# Altium schematic sheet 05pwr_input.SchDoc
size B
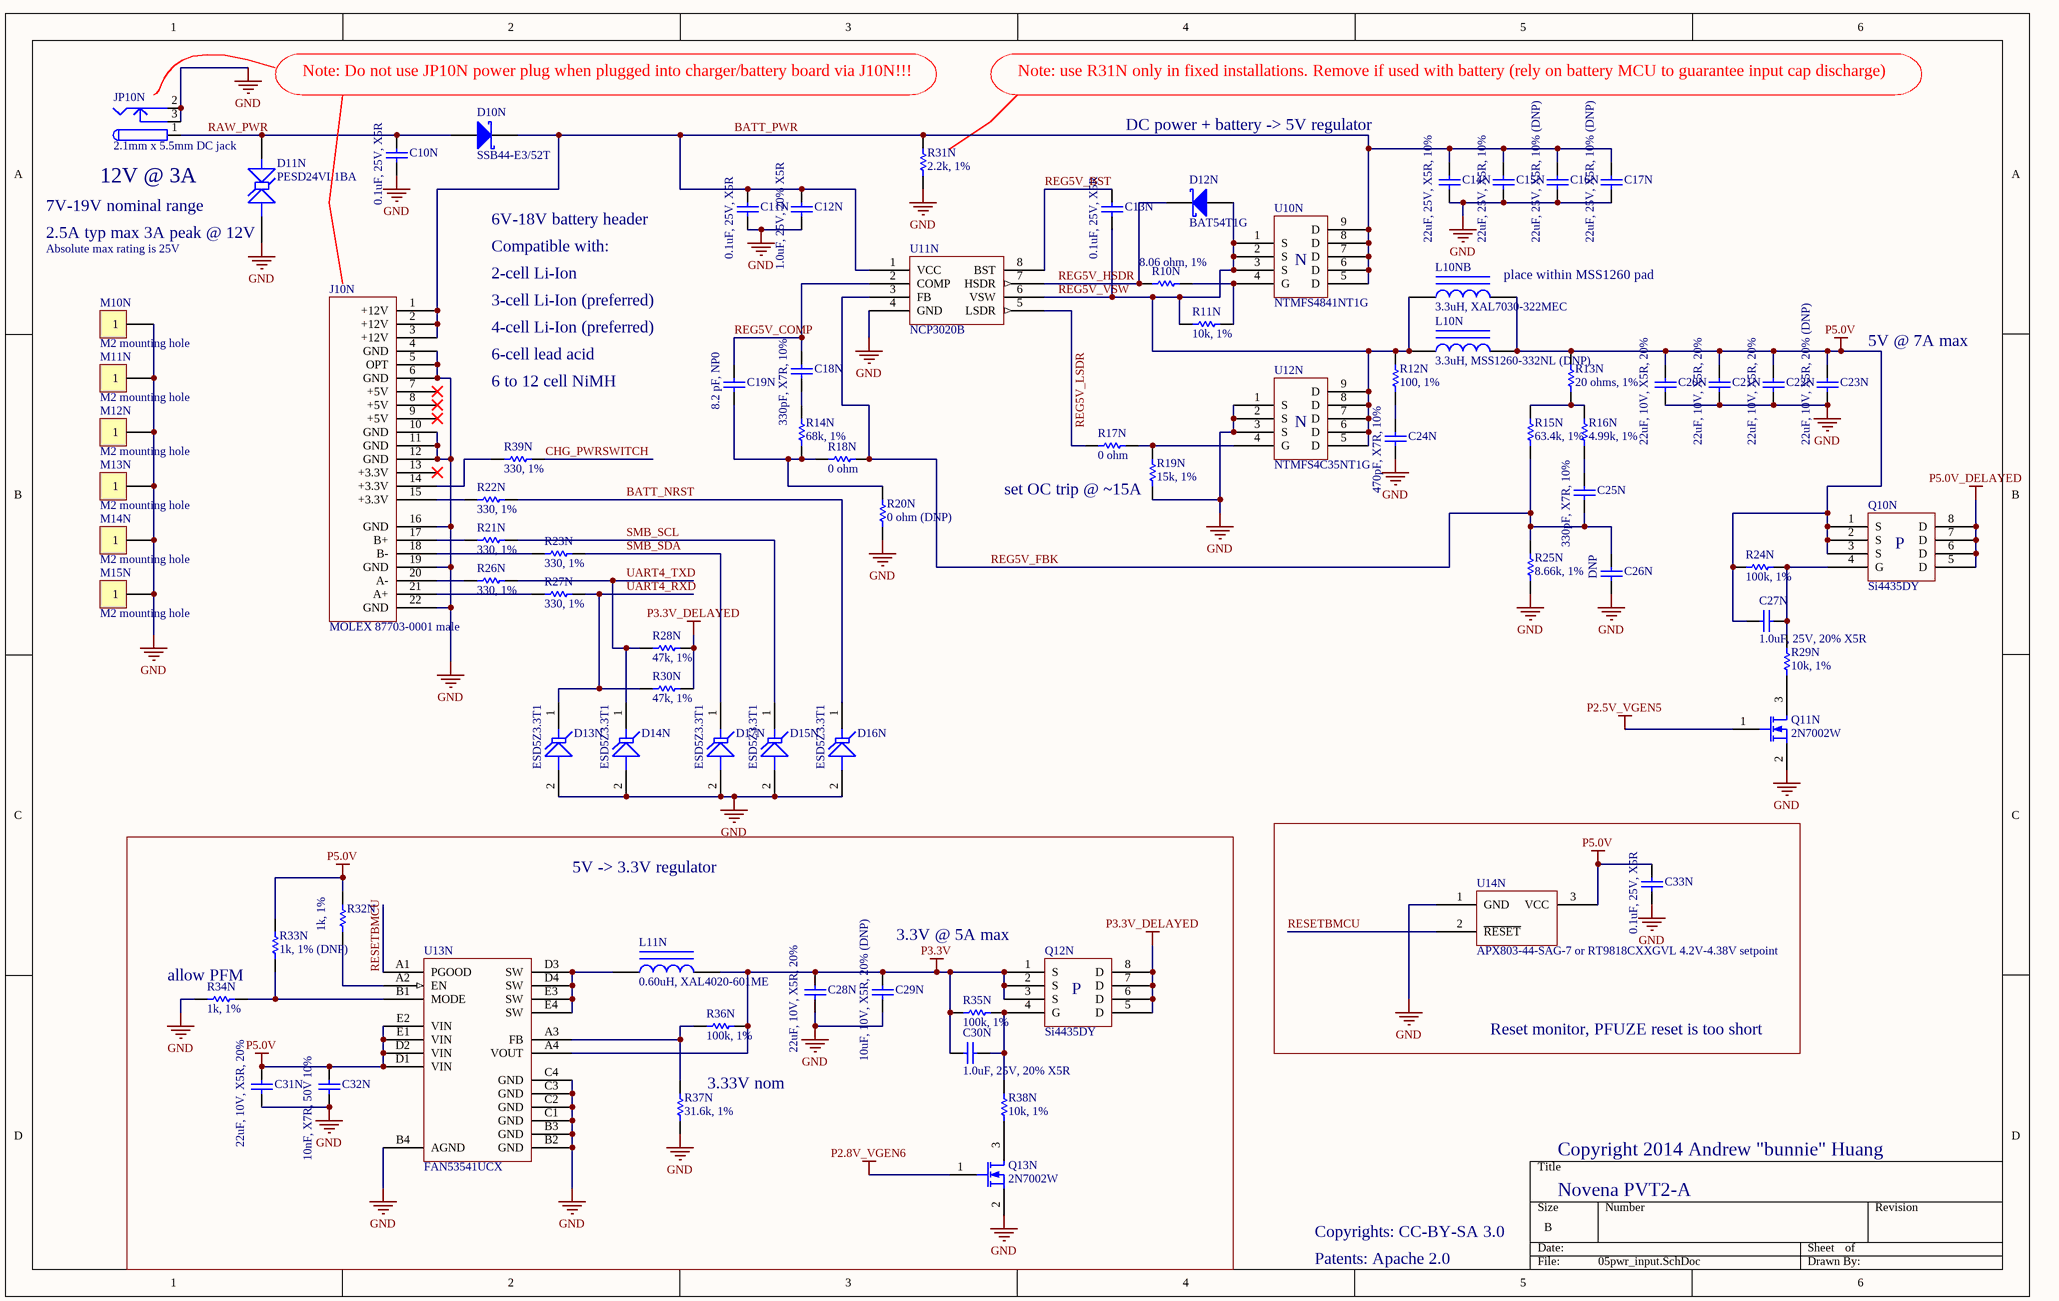
[diagram p0: 05pwr_input.SchDoc]

## Parts
C10N  0.1uF, 25V, X5R  [CAPC1005N]
C11N  0.1uF, 25V, X5R  [CAPC1005N]
C12N  1.0uF, 25V, 20% X5R  [CAPC1608N]
C13N  0.1uF, 25V, X5R  [CAPC1005N]
C14N  22uF, 25V, X5R, 10%  [CAPC3225N]
C15N  22uF, 25V, X5R, 10%  [CAPC3225N]
C16N  22uF, 25V, X5R, 10% (DNP)  [CAPC3225N]
C17N  22uF, 25V, X5R, 10% (DNP)  [CAPC3225N]
C18N  330pF, X7R, 10%  [CAPC1005N]
C19N  8.2 pF, NP0  [CAPC1005N]
C20N  22uF, 10V, X5R, 20%  [CAPC2012N]
C21N  22uF, 10V, X5R, 20%  [CAPC2012N]
C22N  22uF, 10V, X5R, 20%  [CAPC2012N]
C23N  22uF, 10V, X5R, 20% (DNP)  [CAPC2012N]
C24N  470pF, X7R, 10%  [CAPC1005N]
C25N  330pF, X7R, 10%  [CAPC1005N]
C26N  DNP  [CAPC1005N]
C27N  1.0uF, 25V, 20% X5R  [CAPC1608N]
C28N  22uF, 10V, X5R, 20%  [CAPC2012N]
C29N  10uF, 10V, X5R, 20% (DNP)  [CAPC1608N]
C30N  1.0uF, 25V, 20% X5R  [CAPC1608N]
C31N  22uF, 10V, X5R, 20%  [CAPC2012N]
C32N  10nF, X7R, 50V 10%  [CAPC1005N]
C33N  0.1uF, 25V, X5R  [CAPC1005N]
D10N  SSB44-E3/52T  [DSO-C2/X2.3]
D11N  PESD24VL1BA  [SOD-323]
D12N  BAT54T1G  [SOD123]
D13N  ESD5Z3.3T1  [SOD-523]
D14N  ESD5Z3.3T1  [SOD-523]
D15N  ESD5Z3.3T1  [SOD-523]
D16N  ESD5Z3.3T1  [SOD-523]
D17N  ESD5Z3.3T1  [SOD-523]
J10N  MOLEX 87703-0001 male  [SATA_MOLEX-87703-0001]
JP10N  2.1mm x 5.5mm DC jack  [CUI_PJ_002AH_SMT]
L10N  3.3uH, MSS1260-332NL (DNP)  [COILCRAFT_MSS1048]
L10NB  3.3uH, XAL7030-322MEC  [COILCRAFT_XAL7030]
L11N  0.60uH, XAL4020-601ME  [COILCRAFT_XAL4020]
M10N  M2 mounting hole  [HOLE_M2_MOUNT]
M11N  M2 mounting hole  [HOLE_M2_MOUNT]
M12N  M2 mounting hole  [HOLE_M2_MOUNT]
M13N  M2 mounting hole  [HOLE_M2_MOUNT]
M14N  M2 mounting hole  [HOLE_M2_MOUNT]
M15N  M2 mounting hole  [HOLE_M2_MOUNT]
Q10N  Si4435DY  [SOIC127P600-8AN]
Q11N  2N7002W  [SOT323-3AN]
Q12N  Si4435DY  [SOIC127P600-8AN]
Q13N  2N7002W  [SOT323-3AN]
R10N  8.06 ohm, 1%  [RESC1005N]
R11N  10k, 1%  [RESC1005N]
R12N  100, 1%  [RESC1005N]
R13N  20 ohms, 1%  [RESC1005N]
R14N  68k, 1%  [RESC1005N]
R15N  63.4k, 1%  [RESC1005N]
R16N  4.99k, 1%  [RESC1005N]
R17N  0 ohm  [RESC1005N]
R18N  0 ohm  [RESC1005N]
R19N  15k, 1%  [RESC1005N]
R20N  0 ohm (DNP)  [RESC1005N]
R21N  330, 1%  [RESC1005N]
R22N  330, 1%  [RESC1005N]
R23N  330, 1%  [RESC1005N]
R24N  100k, 1%  [RESC1005N]
R25N  8.66k, 1%  [RESC1005N]
R26N  330, 1%  [RESC1005N]
R27N  330, 1%  [RESC1005N]
R28N  47k, 1%  [RESC1005N]
R29N  10k, 1%  [RESC1005N]
R30N  47k, 1%  [RESC1005N]
R31N  2.2k, 1%  [RESC1005N]
R32N  1k, 1%  [RESC1005N]
R33N  1k, 1% (DNP)  [RESC1005N]
R34N  1k, 1%  [RESC1005N]
R35N  100k, 1%  [RESC1005N]
R36N  100k, 1%  [RESC1005N]
R37N  31.6k, 1%  [RESC1005N]
R38N  10k, 1%  [RESC1005N]
R39N  330, 1%  [RESC1005N]
U10N  NTMFS4841NT1G  [ONSEMI_DFN5_5x6_1.27P]
U11N  NCP3020B  [SOIC127P600-8AN]
U12N  NTMFS4C35NT1G  [ONSEMI_DFN5_5x6_1.27P]
U13N  FAN53541UCX  [FAIRCHILD_WLCSP_BGA100P9X9-81A]
U14N  APX803-44-SAG-7 or RT9818CXXGVL 4.2V-4.38V setpoint  [SOT23-3N]

## Blocks framed on the sheet
Reset monitor, PFUZE reset is too short: C33N U14N

## Nets
GND: C10N.2 C11N.2 C12N.2 C14N.2 C15N.2 C16N.2 C17N.2 C20N.2 C21N.2 C22N.2 C23N.2 C24N.2 C26N.2 C28N.2 C29N.2 C31N.2 C32N.2 C33N.2 D11N.1(A) D13N.2(A) D14N.2(A) D15N.2(A) D16N.2(A) D17N.2(A) J10N.4(GND) J10N.5(OPT) J10N.6(GND) J10N.10(GND) J10N.11(GND) J10N.12(GND) J10N.16(GND) J10N.19(GND) J10N.22(GND) JP10N.2 JP10N.3 M10N.1 M11N.1 M12N.1 M13N.1 M14N.1 M15N.1 Q11N.2(S) Q13N.2(S) R19N.1 R20N.1 R25N.1 R31N.1 R34N.2 R37N.1 U11N.4(GND) U12N.1(S) U12N.2(S) U12N.3(S) U13N.B2(GND) U13N.B3(GND) U13N.B4(AGND) U13N.C1(GND) U13N.C2(GND) U13N.C3(GND) U13N.C4(GND) U14N.1(GND)
P2.5V_VGEN5: Q11N.1(G)
P2.8V_VGEN6: Q13N.1(G)
P3.3V: C28N.1 C29N.1 C30N.1 L11N.2 Q12N.1(S) Q12N.2(S) Q12N.3(S) R35N.2 R36N.1 U13N.A4(VOUT)
P3.3V_DELAYED: Q12N.5(D) Q12N.6(D) Q12N.7(D) Q12N.8(D) R28N.1 R30N.1
P5.0V: C20N.1 C21N.1 C22N.1 C23N.1 C27N.1 C31N.1 C32N.1 C33N.1 L10N.2 L10NB.2 Q10N.1(S) Q10N.2(S) Q10N.3(S) R13N.2 R24N.2 R32N.1 R33N.2 U13N.D1(VIN) U13N.D2(VIN) U13N.E1(VIN) U13N.E2(VIN) U14N.3(VCC)
P5.0V_DELAYED: Q10N.5(D) Q10N.6(D) Q10N.7(D) Q10N.8(D)
BATT_NRST: D16N.1(K) R22N.2
BATT_PWR: C11N.1 C12N.1 C14N.1 C15N.1 C16N.1 C17N.1 D10N.2(K) J10N.1(+12V) J10N.2(+12V) J10N.3(+12V) R31N.2 U10N.5(D) U10N.6(D) U10N.7(D) U10N.8(D) U10N.9(D) U11N.1(VCC)
CHG_PWRSWITCH: R39N.2
RAW_PWR: C10N.1 D10N.1(A) D11N.2(K) JP10N.1
REG5V_BST: C13N.1 U11N.8(BST)
REG5V_COMP: C18N.1 C19N.1 U11N.2(COMP)
REG5V_FBK: C25N.2 C26N.1 R15N.1 R18N.2 R25N.2 U11N.3(FB)
REG5V_HSDR: D12N.2(K) R10N.1 U11N.7(HSDR)
REG5V_LSDR: R17N.1 U11N.5(LSDR)
REG5V_VSW: C13N.2 D12N.1(A) L10N.1 L10NB.1 R11N.2 R12N.2 U10N.1(S) U10N.2(S) U10N.3(S) U11N.6(VSW) U12N.5(D) U12N.6(D) U12N.7(D) U12N.8(D) U12N.9(D)
RESETBMCU: U13N.A1(PGOOD) U14N.2(~{RESET})
SMB_SCL: D15N.1(K) R21N.1
SMB_SDA: D17N.1(K) R23N.2
UART4_RXD: D13N.1(K) R27N.2 R30N.2
UART4_TXD: D14N.1(K) R26N.2 R28N.2
NetC18N_2: C18N.2 R14N.2
NetC19N_2: C19N.2 R14N.1 R18N.1 R20N.2
NetC24N_1: C24N.1 R12N.1
NetC25N_1: C25N.1 R16N.1
NetC27N_2: C27N.2 Q10N.4(G) R24N.1 R29N.1
NetC30N_2: C30N.2 Q12N.4(G) R35N.1 R38N.1
NetJ10N_14: J10N.14(+3.3V) R39N.1
NetJ10N_15: J10N.15(+3.3V) R22N.1
NetJ10N_17: J10N.17(B+) R21N.2
NetJ10N_18: J10N.18(B-) R23N.1
NetJ10N_20: J10N.20(A-) R26N.1
NetJ10N_21: J10N.21(A+) R27N.1
NetL11N_1: L11N.1 U13N.D3(SW) U13N.D4(SW) U13N.E3(SW) U13N.E4(SW)
NetQ11N_3: Q11N.3(D) R29N.2
NetQ13N_3: Q13N.3(D) R38N.2
NetR10N_2: R10N.2 R11N.1 U10N.4(G)
NetR13N_1: R13N.1 R15N.2 R16N.2
NetR17N_2: R17N.2 R19N.2 U12N.4(G)
NetR32N_2: R32N.2 U13N.A2(EN)
NetR33N_1: R33N.1 R34N.1 U13N.B1(MODE)
NetR36N_2: R36N.2 R37N.2 U13N.A3(FB)

Not connected (* = marked no-connect by the designer): J10N 7(+5V)* 8(+5V)* 9(+5V)* 13(+3.3V)*

## Notes on the sheet
- Note: Do not use JP10N power plug when plugged into charger/battery board via J10N!!!
- Note: use R31N only in fixed installations. Remove if used with battery (rely on battery MCU to guarantee input cap discharge)
- DC power + battery -> 5V regulator
- 7V-19V nominal range
- (near D11N) 2.5A typ max 3A peak @ 12V
- (near JP10N) 12V @ 3A
- 6V-18V battery header
- Absolute max rating is 25V
- Compatible with:
- 2-cell Li-Ion
- 3-cell Li-Ion (preferred)
- (near L10NB) place within MSS1260 pad
- 6-cell lead acid
- (near C19N) 4-cell Li-Ion (preferred)
- (near C23N) 5V @ 7A max
- 6 to 12 cell NiMH
- (near R19N) set OC trip @ ~15A
- 5V -> 3.3V regulator
- (near R34N) allow PFM
- 3.3V @ 5A max
- (near R37N) 3.33V nom
- Copyright 2014 Andrew "bunnie" Huang
- Copyrights: CC-BY-SA 3.0
- Novena PVT2-A
- Patents: Apache 2.0
- (in symbol NTMFS4841N) N
- (in symbol Si4435DY) P

## Library data of the parts
C10N C11N C12N C13N C14N C15N C16N C17N C18N C19N C20N C21N C22N C23N C24N C25N C26N C27N C28N C29N C30N C31N C32N C33N = Cap Semi: Capacitor (Semiconductor SIM Model); Published: 8-Jun-2000; LatestRevisionDate: 17-Jul-2002; LatestRevisionNote: Re-released for DXP Platform.; PackageReference: C1206; Publisher: Altium Limited
D10N D12N = D Schottky: Schottky Diode; Code - JEDEC: DO-214-AA; Published: 8-Jun-2000; Publisher: Altium Limited; Revision: July-2002: Re-released for DXP Platform.
D11N = BIDIR_ESD: Bidirectional zener diode, Vz 17.1V nom
D13N D14N D15N D16N D17N = Tranzorb: On Semi 3.3V standoff TVS diode; Published: 24-Mar-1999; LatestRevisionDate: 17-Jul-2002; LatestRevisionNote: Re-released for DXP Platform.; PackageReference: DO-7; Publisher: Altium Limited
J10N = SATA_22P_HEADER: SATA+Power connector
JP10N = PWR2.5: Low Voltage Power Supply Connector; Published: 17-Dec-2003; Datasheet: Latest Revision: 09-May-2002; Publisher: Altium Limited
L10N L10NB L11N = Inductor Iron: Magnetic-Core Inductor; Published: 24-Mar-1999; LatestRevisionDate: 17-Jul-2002; LatestRevisionNote: Re-released for DXP Platform.; PackageReference: AXIAL-0.9; Publisher: Altium Limited
M10N M11N M12N M13N M14N M15N = CON1: Connector
Q10N Q12N = Si4435DY: Singre P-channel FET, 8A, 30V
Q11N Q13N = MOSFET-N: N-Channel MOSFET; Published: 8-Jun-2000; LatestRevisionDate: 17-Jul-2002; LatestRevisionNote: Re-released for DXP Platform.; PackageVersion: 1995/1996; PackageReference: E3; Publisher: Altium Limited
R10N R11N R12N R13N R14N R15N R16N R17N R18N R19N R20N R21N R22N R23N R25N R26N R27N R28N R29N R30N R31N R32N R33N R34N R37N R38N R39N = Res1: Resistor; Value: 100k; Published: 8-Jun-2000; LatestRevisionDate: 17-Jul-2002; LatestRevisionNote: Re-released for DXP Platform.; PackageReference: AXIAL-0.3; Publisher: Altium Limited
R24N R35N R36N = Res1: Resistor; Published: 8-Jun-2000; LatestRevisionDate: 17-Jul-2002; LatestRevisionNote: Re-released for DXP Platform.; PackageReference: AXIAL-0.3; Publisher: Altium Limited; Value: 100k
U10N U12N = NTMFS4841N: N channel power MOSFET, 30V, 57A SO-8FL
U11N = NCP3020B: Synchronous PWM controller, 4.7-28V in, 0.6V ref
U13N = FAN53540UCX: 2.4MHz 5A Sync buck regulator, integrated FET
U14N = RESET_SOT23: Reset monitor. Voltage specified by XX in P/N. Multiple vendors.